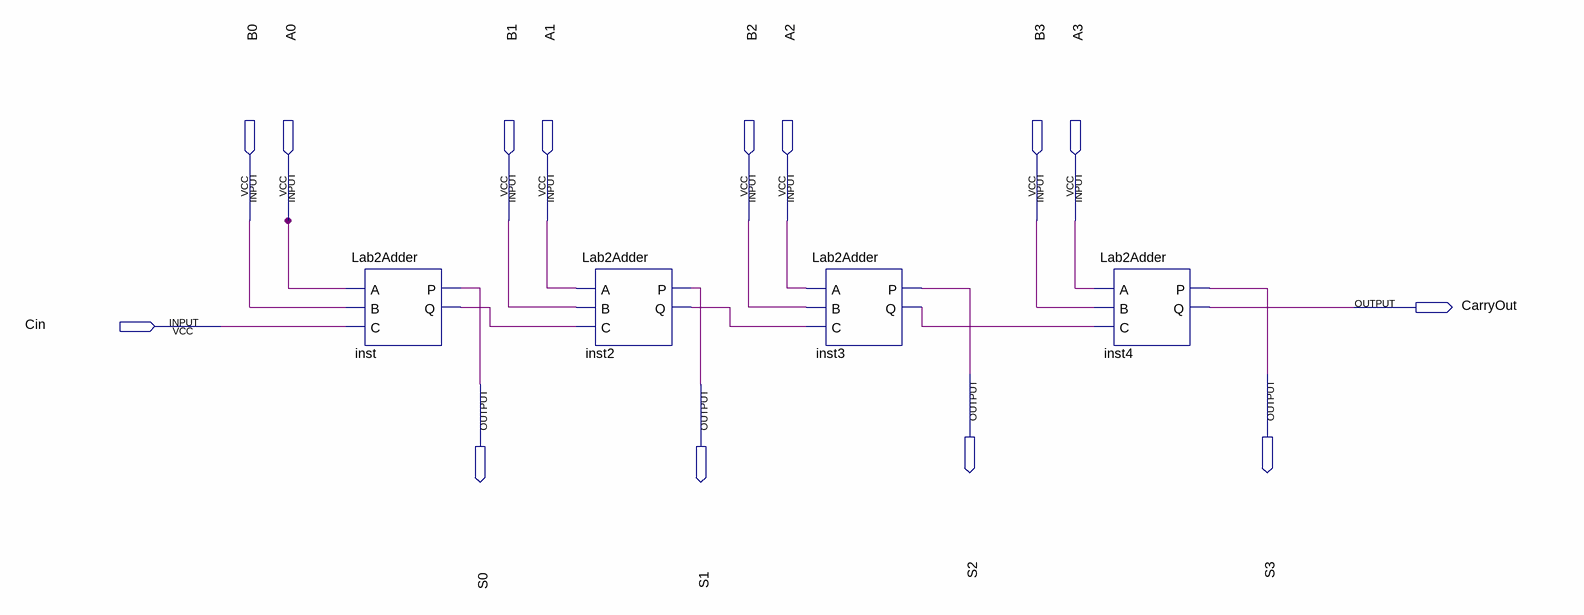
[diagram p0: schematic sheet]
// Quartus schematic RippleAdder.bdf as structural Verilog: 4 symbols, 14 pins
module RippleAdder (
  input  B0,
  input  A0,
  input  B1,
  input  A1,
  input  B2,
  input  A2,
  input  B3,
  input  A3,
  input  Cin,
  output CarryOut,
  output S2,
  output S3,
  output S0,
  output S1
);

  wire inst2_q, inst3_q, inst_q;

  Lab2Adder inst (.A(A0), .B(B0), .C(Cin), .P(S0), .Q(inst_q));
  Lab2Adder inst2 (.A(A1), .B(B1), .C(inst_q), .P(S1), .Q(inst2_q));
  Lab2Adder inst3 (.A(A2), .B(B2), .C(inst2_q), .P(S2), .Q(inst3_q));
  Lab2Adder inst4 (.A(A3), .B(B3), .C(inst3_q), .P(S3), .Q(CarryOut));
endmodule
